# EasyEDA Pro project coildriver_new.eprj

# Schematic Schematic1
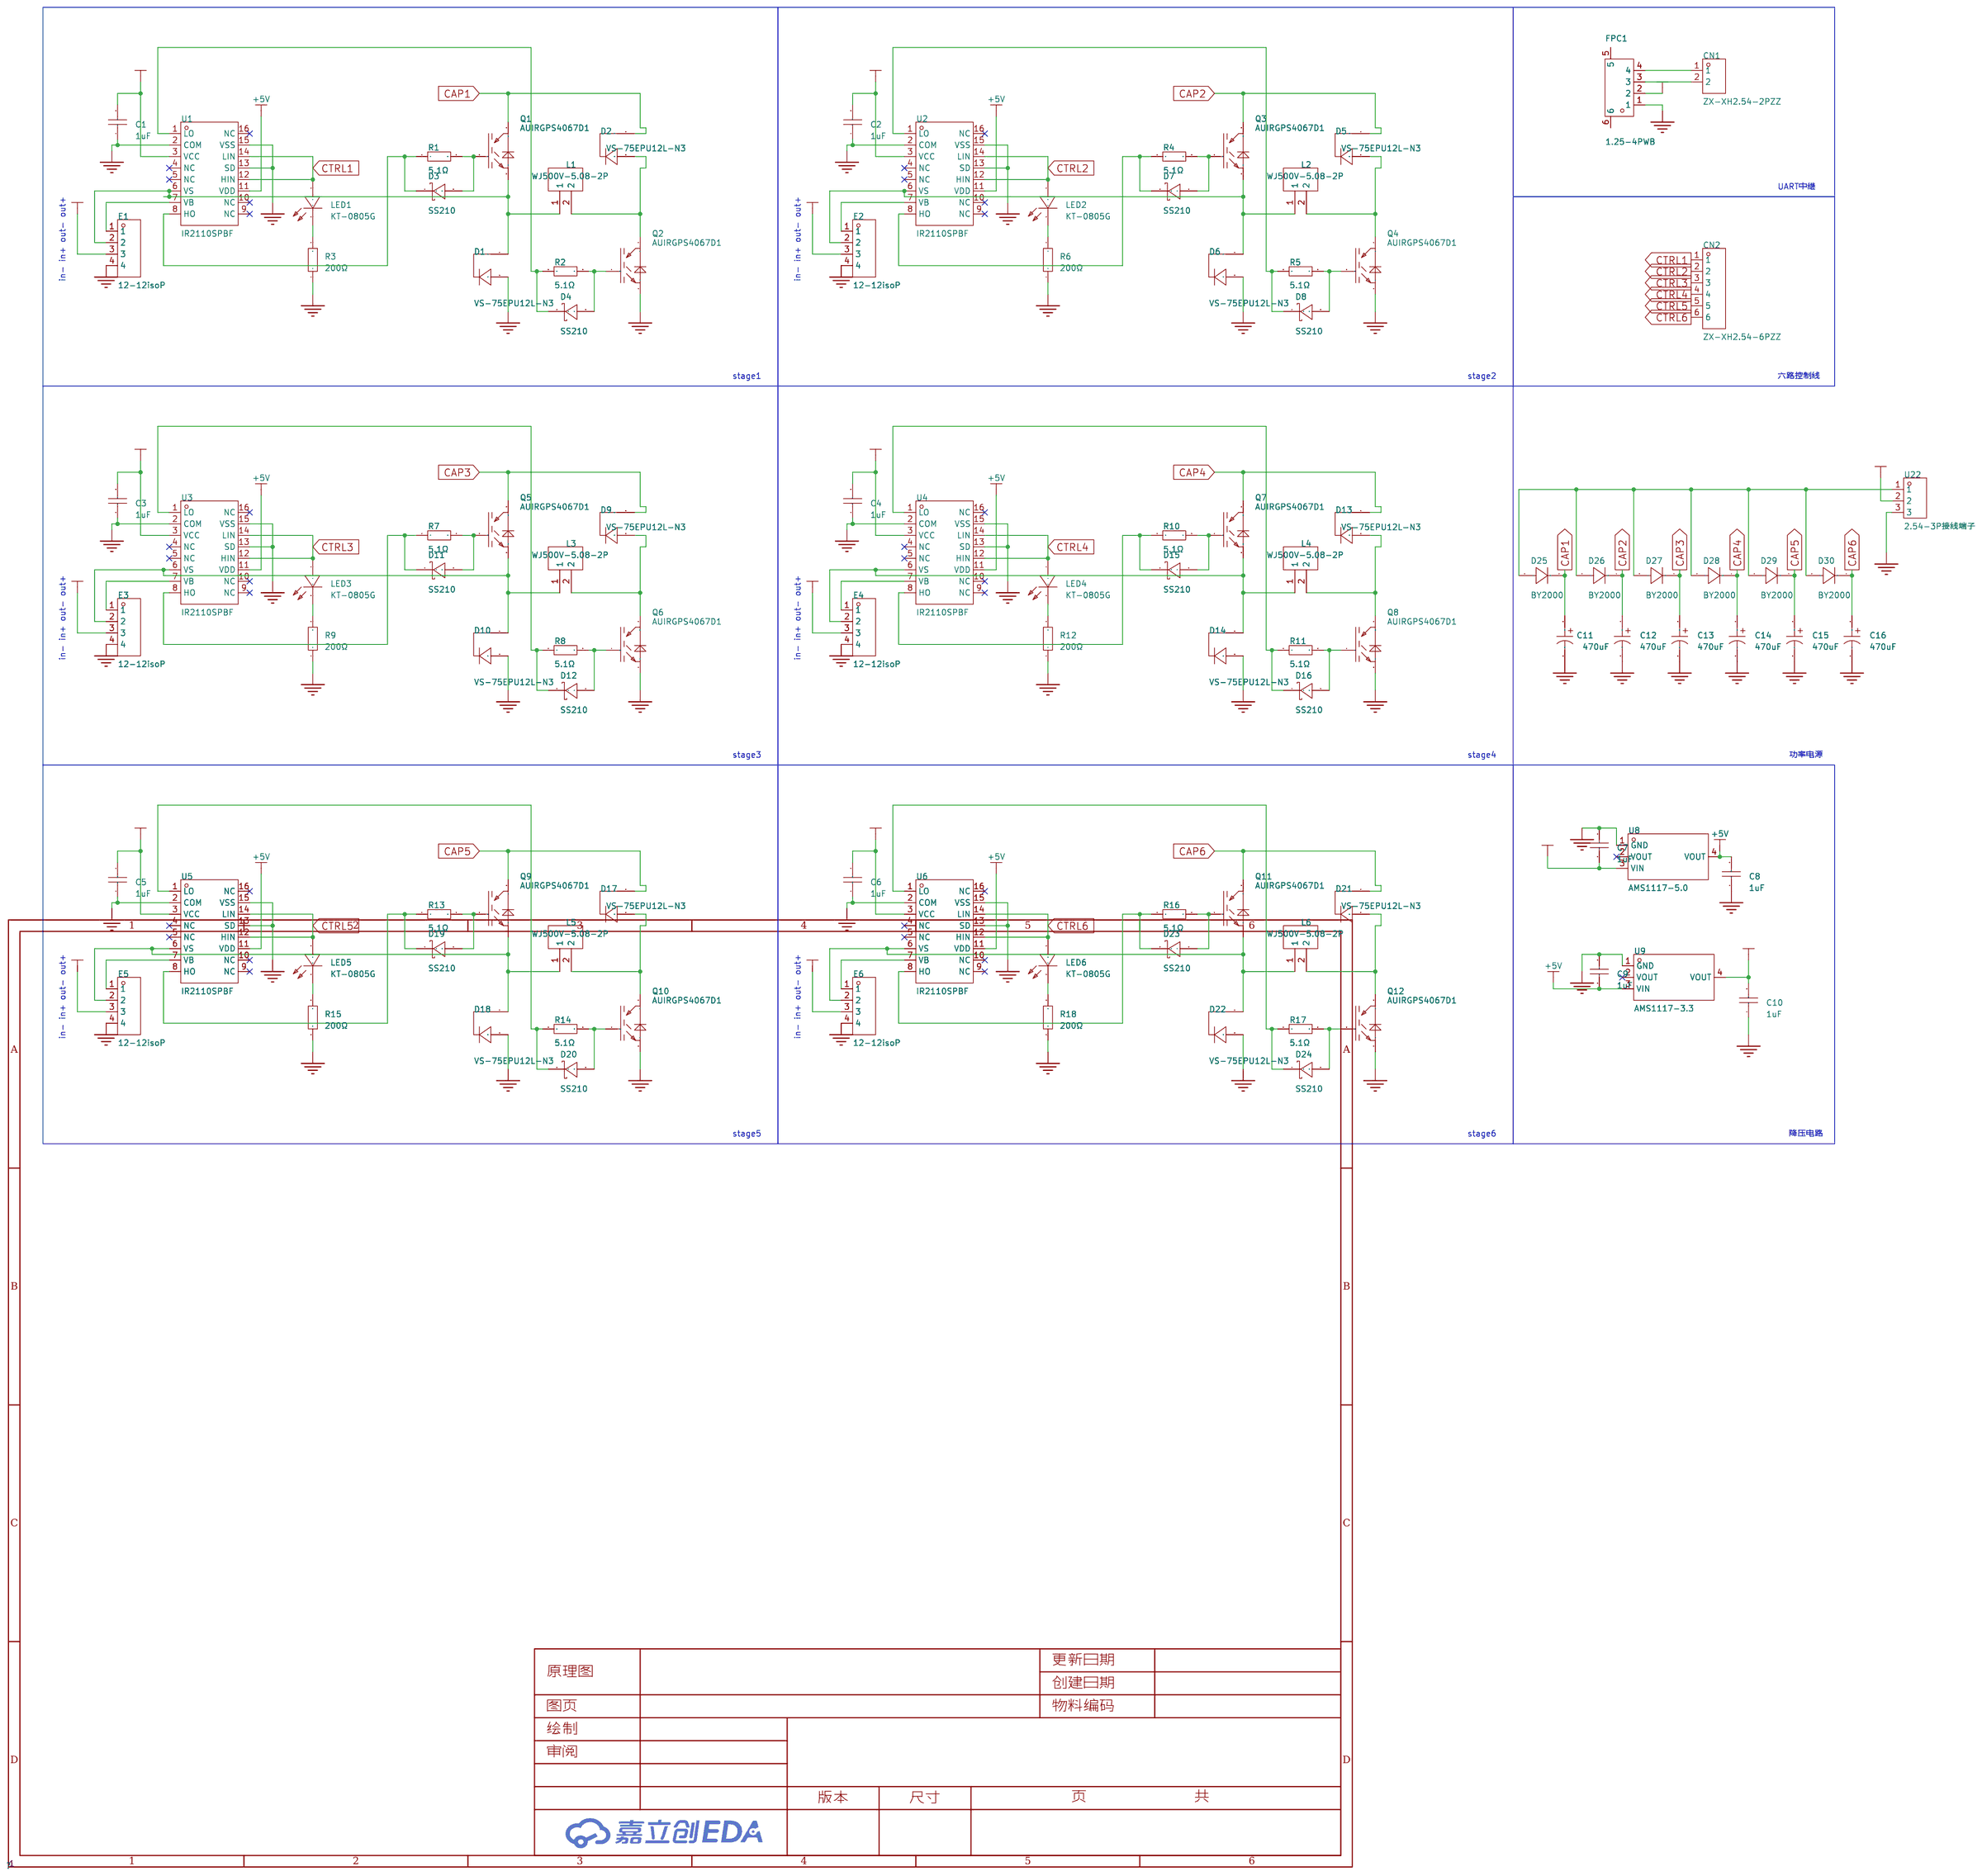
[diagram p0: schematic sheet]

## Parts
C1  1uF  [C0805]
C2  1uF  [C0805]
C3  1uF  [C0805]
C4  1uF  [C0805]
C5  1uF  [C0805]
C6  1uF  [C0805]
C7  1uF  [C0805]
C8  1uF  [C0805]
C9  1uF  [C0805]
C10  1uF  [C0805]
C11  470uF  [CAP-TH_BD35.0-P10.00-D2.3-FD]
C12  470uF  [CAP-TH_BD35.0-P10.00-D2.3-FD]
C13  470uF  [CAP-TH_BD35.0-P10.00-D2.3-FD]
C14  470uF  [CAP-TH_BD35.0-P10.00-D2.3-FD]
C15  470uF  [CAP-TH_BD35.0-P10.00-D2.3-FD]
C16  470uF  [CAP-TH_BD35.0-P10.00-D2.3-FD]
CN1  ZX-XH2.54-2PZZ  [CONN-TH_2P-P2.50_HX25003-2A]
CN2  ZX-XH2.54-6PZZ  [CONN-TH_6P-P2.50_ZX-XH2.54-6PZZ]
D1  VS-75EPU12L-N3  [TO-247-2_L15.8-W5.0-P10.92-L]
D2  VS-75EPU12L-N3  [TO-247-2_L15.8-W5.0-P10.92-L]
D3  SS210  [SMA_L4.3-W2.6-LS5.2-RD]
D4  SS210  [SMA_L4.3-W2.6-LS5.2-RD]
D5  VS-75EPU12L-N3  [TO-247-2_L15.8-W5.0-P10.92-L]
D6  VS-75EPU12L-N3  [TO-247-2_L15.8-W5.0-P10.92-L]
D7  SS210  [SMA_L4.3-W2.6-LS5.2-RD]
D8  SS210  [SMA_L4.3-W2.6-LS5.2-RD]
D9  VS-75EPU12L-N3  [TO-247-2_L15.8-W5.0-P10.92-L]
D10  VS-75EPU12L-N3  [TO-247-2_L15.8-W5.0-P10.92-L]
D11  SS210  [SMA_L4.3-W2.6-LS5.2-RD]
D12  SS210  [SMA_L4.3-W2.6-LS5.2-RD]
D13  VS-75EPU12L-N3  [TO-247-2_L15.8-W5.0-P10.92-L]
D14  VS-75EPU12L-N3  [TO-247-2_L15.8-W5.0-P10.92-L]
D15  SS210  [SMA_L4.3-W2.6-LS5.2-RD]
D16  SS210  [SMA_L4.3-W2.6-LS5.2-RD]
D17  VS-75EPU12L-N3  [TO-247-2_L15.8-W5.0-P10.92-L]
D18  VS-75EPU12L-N3  [TO-247-2_L15.8-W5.0-P10.92-L]
D19  SS210  [SMA_L4.3-W2.6-LS5.2-RD]
D20  SS210  [SMA_L4.3-W2.6-LS5.2-RD]
D21  VS-75EPU12L-N3  [TO-247-2_L15.8-W5.0-P10.92-L]
D22  VS-75EPU12L-N3  [TO-247-2_L15.8-W5.0-P10.92-L]
D23  SS210  [SMA_L4.3-W2.6-LS5.2-RD]
D24  SS210  [SMA_L4.3-W2.6-LS5.2-RD]
D25  BY2000  [DO-201_BD4.5-L7.5-P11.50-D1.2-RD]
D26  BY2000  [DO-201_BD4.5-L7.5-P11.50-D1.2-RD]
D27  BY2000  [DO-201_BD4.5-L7.5-P11.50-D1.2-RD]
D28  BY2000  [DO-201_BD4.5-L7.5-P11.50-D1.2-RD]
D29  BY2000  [DO-201_BD4.5-L7.5-P11.50-D1.2-RD]
D30  BY2000  [DO-201_BD4.5-L7.5-P11.50-D1.2-RD]
E1  12-12isoP  [HDR-TH_4P-P2.54-V-M]
E2  12-12isoP  [HDR-TH_4P-P2.54-V-M]
E3  12-12isoP  [HDR-TH_4P-P2.54-V-M]
E4  12-12isoP  [HDR-TH_4P-P2.54-V-M]
E5  12-12isoP  [HDR-TH_4P-P2.54-V-M]
E6  12-12isoP  [HDR-TH_4P-P2.54-V-M]
FPC1  1.25-4PWB  [CONN-SMD_1.25-4PWB]
L1  WJ500V-5.08-2P  [CONN-TH_2P-P5.00_WJ500V-5.08-2P]
L2  WJ500V-5.08-2P  [CONN-TH_2P-P5.00_WJ500V-5.08-2P]
L3  WJ500V-5.08-2P  [CONN-TH_2P-P5.00_WJ500V-5.08-2P]
L4  WJ500V-5.08-2P  [CONN-TH_2P-P5.00_WJ500V-5.08-2P]
L5  WJ500V-5.08-2P  [CONN-TH_2P-P5.00_WJ500V-5.08-2P]
L6  WJ500V-5.08-2P  [CONN-TH_2P-P5.00_WJ500V-5.08-2P]
LED1  KT-0805G  [LED0805-R-RD]
LED2  KT-0805G  [LED0805-R-RD]
LED3  KT-0805G  [LED0805-R-RD]
LED4  KT-0805G  [LED0805-R-RD]
LED5  KT-0805G  [LED0805-R-RD]
LED6  KT-0805G  [LED0805-R-RD]
Q1  AUIRGPS4067D1  [SUPER-247_L15.6-W5.0-P5.45-L]
Q2  AUIRGPS4067D1  [SUPER-247_L15.6-W5.0-P5.45-L]
Q3  AUIRGPS4067D1  [SUPER-247_L15.6-W5.0-P5.45-L]
Q4  AUIRGPS4067D1  [SUPER-247_L15.6-W5.0-P5.45-L]
Q5  AUIRGPS4067D1  [SUPER-247_L15.6-W5.0-P5.45-L]
Q6  AUIRGPS4067D1  [SUPER-247_L15.6-W5.0-P5.45-L]
Q7  AUIRGPS4067D1  [SUPER-247_L15.6-W5.0-P5.45-L]
Q8  AUIRGPS4067D1  [SUPER-247_L15.6-W5.0-P5.45-L]
Q9  AUIRGPS4067D1  [SUPER-247_L15.6-W5.0-P5.45-L]
Q10  AUIRGPS4067D1  [SUPER-247_L15.6-W5.0-P5.45-L]
Q11  AUIRGPS4067D1  [SUPER-247_L15.6-W5.0-P5.45-L]
Q12  AUIRGPS4067D1  [SUPER-247_L15.6-W5.0-P5.45-L]
R1  5.1Ω  [R0805]
R2  5.1Ω  [R0805]
R3  200Ω  [R0603]
R4  5.1Ω  [R0805]
R5  5.1Ω  [R0805]
R6  200Ω  [R0603]
R7  5.1Ω  [R0805]
R8  5.1Ω  [R0805]
R9  200Ω  [R0603]
R10  5.1Ω  [R0805]
R11  5.1Ω  [R0805]
R12  200Ω  [R0603]
R13  5.1Ω  [R0805]
R14  5.1Ω  [R0805]
R15  200Ω  [R0603]
R16  5.1Ω  [R0805]
R17  5.1Ω  [R0805]
R18  200Ω  [R0603]
U1  IR2110SPBF  [SOIC-16_L10.3-W7.5-P1.27-LS10.3-BL]
U2  IR2110SPBF  [SOIC-16_L10.3-W7.5-P1.27-LS10.3-BL]
U3  IR2110SPBF  [SOIC-16_L10.3-W7.5-P1.27-LS10.3-BL]
U4  IR2110SPBF  [SOIC-16_L10.3-W7.5-P1.27-LS10.3-BL]
U5  IR2110SPBF  [SOIC-16_L10.3-W7.5-P1.27-LS10.3-BL]
U6  IR2110SPBF  [SOIC-16_L10.3-W7.5-P1.27-LS10.3-BL]
U8  AMS1117-5.0  [SOT-223_L6.5-W3.5-P2.30-LS7.0-BR]
U9  AMS1117-3.3  [SOT-223-3_L6.5-W3.4-P2.30-LS7.0-BR]
U22  2.54-3P接线端子  [CONN-TH_2.54-3P]

## Library data of the parts
C1-C10 = CL21B105KBFNNNE: LCSC Part Name: 1uF ±10% 50V; Supplier Part: C28323; Manufacturer: SAMSUNG(三星); Supplier Footprint: 0805; JLCPCB Part Class: 基础库; Datasheet: https://atta.szlcsc.com/upload/public/pdf/source/20160218/1457707763339.pdf; Supplier: LCSC; Tolerance: ±10%; Voltage Rated: 50V; Temperature Coefficient: X7R
C11-C16 = 450MXG470MEFCSN35X40: LCSC Part Name: 470uF ±20% 450V; Supplier Part: C1581700; Manufacturer: rubycon(红宝石); Supplier Footprint: 插件,D35xL40mm; JLCPCB Part Class: 扩展库; Datasheet: https://atta.szlcsc.com/upload/public/pdf/source/20180704/C239328_ABA397D20D0459C98DC8752DC8B5048F.pdf; Supplier: LCSC; Tolerance: ±20%; Rated Voltage: 450V; Lead Spacing: 10mm; Ripple Current: 1.95A@120Hz; φD: 35mm; L: 40mm; Lifetime @ Temperature: 3000hrs@105℃; Operating Temperature: -25℃~+105℃
CN1 = ZX-XH2.54-2PZZ: Supplier Part: C7429632; Manufacturer: Megastar(兆星); Supplier Footprint: 插件,P=2.54mm; JLCPCB Part Class: 扩展库; Datasheet: https://atta.szlcsc.com/upload/public/pdf/source/20230619/19BA6947230AA44A04D3EDD65E618FD0.pdf; Supplier: LCSC; Pins Structure: 1x2P; Pitch: 2.54mm; Mounting Style: 直插; Reference Series: XH; Number of Pins: 2P; Number of Rows: 1; Number of PINs Per Row: 2; Current Rating (Max): 3A; Contact Material: 黄铜; Contact Plating: 锡; Operating Temperature Range: -25℃~+85℃
CN2 = ZX-XH2.54-6PZZ: Supplier Part: C7429636; Manufacturer: Megastar(兆星); Supplier Footprint: 插件,P=2.54mm; JLCPCB Part Class: 扩展库; Datasheet: https://atta.szlcsc.com/upload/public/pdf/source/20230619/1243AD0A516E39CD3D274D8985780568.pdf; Supplier: LCSC; Pins Structure: 1x6P; Pitch: 2.54mm; Mounting Style: 直插; Reference Series: XH; Number of Pins: 6P; Number of Rows: 1; Number of PINs Per Row: 6; Current Rating (Max): 3A; Contact Material: 黄铜; Contact Plating: 锡; Operating Temperature Range: -25℃~+85℃
D1 D2 D5 D6 D9 D10 D13 D14 D17 D18 D21 D22 = VS-75EPU12L-N3: LCSC Part Name: 电压:1.2kV 电流:75A; Supplier Part: C335787; Manufacturer: VISHAY(威世); Supplier Footprint: TO-247-2; JLCPCB Part Class: 扩展库; Datasheet: https://atta.szlcsc.com/upload/public/pdf/source/20181127/C335787_ECD477527F5F67B2867CBD5AAE4D0851.pdf; Supplier: LCSC; Diode Configuration: 独立式; Forward Voltage (Vf@If): 2.05V@75A; Reverse Voltage (Vr): 1.2kV; Average Rectified Current (Io): 75A; Reverse Leakage Current: 420uA@1.2kV
D3 D4 D7 D8 D11 D12 D15 D16 D19 D20 D23 D24 = SS210_C14996: LCSC Part Name: 电压:100V 电流:2A; Supplier Part: C14996; Manufacturer: MDD(辰达半导体); Supplier Footprint: SMA(DO-214AC); JLCPCB Part Class: 基础库; Datasheet: https://atta.szlcsc.com/upload/public/pdf/source/20190304/C64992_81A6AAD91A0C3D7B2CCF28903A443273.pdf; Supplier: LCSC; Forward Voltage (Vf@If): 850mV@2A; Reverse Voltage (Vr): 100V; Rectified Current: 2A; Reverse Leakage Current (Ir): 500uA@100V
D25-D30 = BY2000: LCSC Part Name: 电压:2kV 电流:3A; Supplier Part: C2974487; Manufacturer: DIOTEC(德欧泰克); Supplier Footprint: DO-201; JLCPCB Part Class: 扩展库; Datasheet: https://atta.szlcsc.com/upload/public/pdf/source/20220211/92502A012F51F25BCFF5D62494F8C595.pdf; Supplier: LCSC; Forward Voltage (Vf@If): 1.1V@3A; Reverse Voltage (Vr): 2kV; Rectified Current: 3A; Reverse Leakage Current: 5uA@2kV
E1-E6 = PZ254V-11-04P: LCSC Part Name: 间距:2.54mm 1x4P 直插 方针; Supplier Part: C2691448; Manufacturer: XFCN(兴飞); Supplier Footprint: 插件,P=2.54mm; JLCPCB Part Class: 扩展库; Datasheet: https://atta.szlcsc.com/upload/public/pdf/source/20200309/C492403_F9F19131791D08044AD4F84F8E751A34.pdf; Supplier: LCSC; Pin Structure: 1x4P; Pitch: 2.54mm; Circluar Pins/Square Pins: 方针; Mounting Type: 直插; Number of Rows: 单排; Number of Pins: 4P; Current Rating (Max): 3A; Voltage Rating (Max): 250V; Length of Mating Pin: 6mm; Insulation Height: 2.5mm; Length of End Connection Pin: 3mm; Operating Temperature Range: -40℃~+105℃; Color: 黑色
FPC1 = 1.25-4PWB: LCSC Part Name: 1x4P 间距:1.25mm 卧贴; Supplier Part: C2905011; Manufacturer: DEALON(德艺隆); Supplier Footprint: SMD,P=1.25mm,卧贴; JLCPCB Part Class: 扩展库; Datasheet: https://atta.szlcsc.com/upload/public/pdf/source/20231123/1AE0876AE9C7DCFC0D68EAC4CBA881B0.pdf; Supplier: LCSC; Pins Structure: 1x4P; Pitch: 1.25mm; Mounting Style: 卧贴; Number of Pins: 4P; Number of Rows: 1; Number of PINs Per Row: 4; Operating Temperature Range: -40℃~+85℃
L1-L6 = WJ500V-5.08-2P: LCSC Part Name: 1x2P 5.08mm 直插 排数:1 每排P数:2; Supplier Part: C8465; Manufacturer: KANGNEX(康奈克斯电气); Supplier Footprint: 插件,P=5.08mm; JLCPCB Part Class: 扩展库; Datasheet: https://atta.szlcsc.com/upload/public/pdf/source/20191225/C8465_02D34CE5B5B4A53DF5891601D97FA9F4.pdf; Supplier: LCSC; Structure: 1x2P; Pitch: 5.08mm; Color: 绿色; Mounting Style: 直插; Current Rating (Max): 18A; Voltage Rating (Max): 250V; Number of Pins: 2P; Number of Rows: 1; Wire Gauge - AWG: 14~30; Wire Gauge - mm2: 2.5; Number of PINs Per Row: 2; Operating Temperature Range: -40℃~+105℃; Screw Specification: M2.5
LED1-LED6 = KT-0805G: LCSC Part Name: 0805 翠绿 高亮; Supplier Part: C2297; Manufacturer: KENTO; Supplier Footprint: 0805; JLCPCB Part Class: 基础库; Datasheet: https://atta.szlcsc.com/upload/public/pdf/source/20170209/1486607340485.pdf; Supplier: LCSC; Emitted Color: 翠绿色
Q1-Q12 = AUIRGPS4067D1: Supplier Part: C9900044144; Supplier Footprint: Super-247; Supplier: LCSC
R1 R2 R4 R5 R7 R8 R10 R11 R13 R14 R16 R17 = 0805W8F510KT5E: LCSC Part Name: 5.1Ω ±1% 125mW 厚膜电阻; Supplier Part: C17724; Manufacturer: UNI-ROYAL(厚声); Supplier Footprint: 0805; JLCPCB Part Class: 基础库; Datasheet: https://atta.szlcsc.com/upload/public/pdf/source/20200306/C422600_1E6D84923E4A46A82E41ADD87F860B5C.pdf; Supplier: LCSC; Type: 厚膜电阻; Tolerance: ±1%; Power(Watts): 125mW; Overload Voltage (Max): 150V; Temperature Coefficient: ±400ppm/℃; Operating Temperature Range: -55℃~+155℃
R3 R6 R9 R12 R15 R18 = 0603WAF2000T5E: LCSC Part Name: 200Ω ±1% 100mW 厚膜电阻; Supplier Part: C8218; Manufacturer: UNI-ROYAL(厚声); Supplier Footprint: 0603; JLCPCB Part Class: 基础库; Datasheet: https://atta.szlcsc.com/upload/public/pdf/source/20200306/C422600_1E6D84923E4A46A82E41ADD87F860B5C.pdf; Supplier: LCSC; Type: 厚膜电阻; Tolerance: ±1%; Power(Watts): 100mW; Overload Voltage (Max): 75V; Temperature Coefficient: ±100ppm/℃; Operating Temperature Range: -55℃~+155℃
U1-U6 = IR2110SPBF: Supplier Part: C537554; Manufacturer: Infineon(英飞凌); Supplier Footprint: SOIC-16-300mil; JLCPCB Part Class: 扩展库; Datasheet: https://atta.szlcsc.com/upload/public/pdf/source/20200525/C537554_DAB217F314E1627DF0DDC7BBE3BE6BA1.pdf; Supplier: LCSC; Driven Configuration: 半桥; Load Type: MOSFET；IGBT; Number of Drivers: 2; Peak Output Current(sink): 2A; Peak Output Current(source): 2A; Supply Voltage: 3.3V~20V; Rise Time: 25ns; Fall Time: 17ns; Operating Temperature: -40℃~+150℃@(Tj)
U8 = AMS1117-5.0_C6187: LCSC Part Name: 输入12V 输出5V 1A; Supplier Part: C6187; Manufacturer: AMS; Supplier Footprint: SOT-223; JLCPCB Part Class: 基础库; Datasheet: https://atta.szlcsc.com/upload/public/pdf/source/20230918/E4B716057EE82179D88E8A0894830D59.pdf; Supplier: LCSC; Output Type: 固定; Maximum Input Voltage: 12V; Output Voltage: 5V; MAX Output Current: 1A; Power Supply Rejection Ratio (PSRR): 68dB@(120Hz); Dropout Voltage: 1.3V@(1A); Output Polarity: 正极; Number of Outputs: 1
U9 = AMS1117-3.3_C6186: LCSC Part Name: 输出3.3V 1A; Supplier Part: C6186; Manufacturer: AMS; Supplier Footprint: SOT-223; JLCPCB Part Class: 基础库; Datasheet: https://atta.szlcsc.com/upload/public/pdf/source/20180727/C6186_7A095716F0823C02F1997A905E26C086.pdf; Supplier: LCSC; Output Type: 固定; Output Voltage: 3.3V; MAX Output Current: 1A; Power Supply Rejection Ratio (PSRR): 72dB@(120Hz); Dropout Voltage: 1.3V@(800mA); Output Polarity: 正极; Number of Outputs: 1
U22 = 2.54-3P接线端子: LCSC Part Name: 接线端子 2.54mm 3P; Supplier Part: C68305; Manufacturer: BOOMELE(博穆精密); Supplier Footprint: P=2.54mm; JLCPCB Part Class: 扩展库; Datasheet: https://atta.szlcsc.com/upload/public/pdf/source/20240131/0FC6625A1FDA39D18380D30494E5C016.pdf; Supplier: LCSC

## Nets
3V3: C10.2 FPC1.2 U9.4(VOUT)
+5V: C8.2 C9.1 U1.11(VDD) U2.11(VDD) U3.11(VDD) U4.11(VDD) U5.11(VDD) U6.11(VDD) U8.4(VOUT) U9.3(VIN)
+12V: C1.2 C2.2 C3.2 C4.2 C5.2 C6.2 C7.1 E1.3 E2.3 E3.3 E4.3 E5.3 E6.3 U1.3(VCC) U2.3(VCC) U3.3(VCC) U4.3(VCC) U5.3(VCC) U6.3(VCC) U8.3(VIN) U22.2
GND: C1.1 C2.1 C3.1 C4.1 C5.1 C6.1 C7.2 C8.1 C9.2 C10.1 C11.2 C12.2 C13.2 C14.2 C15.2 C16.2 D1.3 D6.3 D10.3 D14.3 D18.3 D22.3 E1.4 E2.4 E3.4 E4.4 E5.4 E6.4 FPC1.1 Q2.3(E) Q4.3(E) Q6.3(E) Q8.3(E) Q10.3(E) Q12.3(E) R3.1 R6.1 R9.1 R12.1 R15.1 R18.1 U1.2(COM) U1.13(SD) U1.15(VSS) U2.2(COM) U2.13(SD) U2.15(VSS) U3.2(COM) U3.13(SD) U3.15(VSS) U4.2(COM) U4.13(SD) U4.15(VSS) U5.2(COM) U5.13(SD) U5.15(VSS) U6.2(COM) U6.13(SD) U6.15(VSS) U8.1(GND) U9.1(GND) U22.3
CAP1: C11.1 D2.1 D25.1(C) Q1.2(C)
CAP2: C12.1 D5.1 D26.1(C) Q3.2(C)
CAP3: C13.1 D9.1 D27.1(C) Q5.2(C)
CAP4: C14.1 D13.1 D28.1(C) Q7.2(C)
CAP5: C15.1 D17.1 D29.1(C) Q9.2(C)
CAP6: C16.1 D21.1 D30.1(C) Q11.2(C)
CTRL1: CN2.1 LED1.1(A) U1.12(HIN) U1.14(LIN)
CTRL2: CN2.2 LED2.1(A) U2.12(HIN) U2.14(LIN)
CTRL3: CN2.3 LED3.1(A) U3.12(HIN) U3.14(LIN)
CTRL4: CN2.4 LED4.1(A) U4.12(HIN) U4.14(LIN)
CTRL5: CN2.5 LED5.1(A) U5.12(HIN) U5.14(LIN)
CTRL6: CN2.6 LED6.1(A) U6.12(HIN) U6.14(LIN)
$1N409: E1.1 U1.7(VB)
$1N414: D1.1 E1.2 L1.1 Q1.3(E) U1.6(VS)
$1N1078: D3.2(A) Q1.1(G) R1.2
$1N1093: D3.1(K) R1.1 U1.8(HO)
$1N1110: D4.1(K) R2.1 U1.1(LO)
$1N1296: D2.3 L1.2 Q2.2(C)
$1N1548: D4.2(A) Q2.1(G) R2.2
$1N1761: LED1.2(K) R3.2
$1N2555: D8.1(K) R5.1 U2.1(LO)
$1N2577: E2.1 U2.7(VB)
$1N2580: D6.1 E2.2 L2.1 Q3.3(E) U2.6(VS)
$1N2587: D7.1(K) R4.1 U2.8(HO)
$1N2596: D7.2(A) Q3.1(G) R4.2
$1N2612: LED2.2(K) R6.2
$1N2625: D5.3 L2.2 Q4.2(C)
$1N2632: D8.2(A) Q4.1(G) R5.2
$1N3371: D12.1(K) R8.1 U3.1(LO)
$1N3393: E3.1 U3.7(VB)
$1N3396: D10.1 E3.2 L3.1 Q5.3(E) U3.6(VS)
$1N3403: D11.1(K) R7.1 U3.8(HO)
$1N3412: D11.2(A) Q5.1(G) R7.2
$1N3428: LED3.2(K) R9.2
$1N3441: D9.3 L3.2 Q6.2(C)
$1N3448: D12.2(A) Q6.1(G) R8.2
$1N4187: D16.1(K) R11.1 U4.1(LO)
$1N4209: E4.1 U4.7(VB)
$1N4212: D14.1 E4.2 L4.1 Q7.3(E) U4.6(VS)
$1N4219: D15.1(K) R10.1 U4.8(HO)
$1N4228: D15.2(A) Q7.1(G) R10.2
$1N4244: LED4.2(K) R12.2
$1N4257: D13.3 L4.2 Q8.2(C)
$1N4264: D16.2(A) Q8.1(G) R11.2
$1N5003: D20.1(K) R14.1 U5.1(LO)
$1N5025: E5.1 U5.7(VB)
$1N5028: D18.1 E5.2 L5.1 Q9.3(E) U5.6(VS)
$1N5035: D19.1(K) R13.1 U5.8(HO)
$1N5044: D19.2(A) Q9.1(G) R13.2
$1N5060: LED5.2(K) R15.2
$1N5073: D17.3 L5.2 Q10.2(C)
$1N5080: D20.2(A) Q10.1(G) R14.2
$1N5819: D24.1(K) R17.1 U6.1(LO)
$1N5841: E6.1 U6.7(VB)
$1N5844: D22.1 E6.2 L6.1 Q11.3(E) U6.6(VS)
$1N5851: D23.1(K) R16.1 U6.8(HO)
$1N5860: D23.2(A) Q11.1(G) R16.2
$1N5876: LED6.2(K) R18.2
$1N5889: D21.3 L6.2 Q12.2(C)
$1N5896: D24.2(A) Q12.1(G) R17.2
$1N6134: CN1.1 FPC1.4
$1N6138: CN1.2 FPC1.3
$1N11573: D25.2(A) D26.2(A) D27.2(A) D28.2(A) D29.2(A) D30.2(A) U22.1

Not connected (* = marked no-connect by the designer): FPC1 5 6; U1 4(NC)* 5(NC)* 9(NC)* 10(NC)* 16(NC)*; U2 4(NC)* 5(NC)* 9(NC)* 10(NC)* 16(NC)*; U3 4(NC)* 5(NC)* 9(NC)* 10(NC)* 16(NC)*; U4 4(NC)* 5(NC)* 9(NC)* 10(NC)* 16(NC)*; U5 4(NC)* 5(NC)* 9(NC)* 10(NC)* 16(NC)*; U6 4(NC)* 5(NC)* 9(NC)* 10(NC)* 16(NC)*; U8 2(VOUT)*; U9 2(VOUT)*

## Notes on the sheet
- UART中继
- in- in+ out- out+
- in- in+ out- out+
- stage1
- stage2
- 六路控制线
- in- in+ out- out+
- in- in+ out- out+
- stage3
- stage4
- 功率电源
- in- in+ out- out+
- in- in+ out- out+
- stage5
- stage6
- 降压电路

# Board PCB1
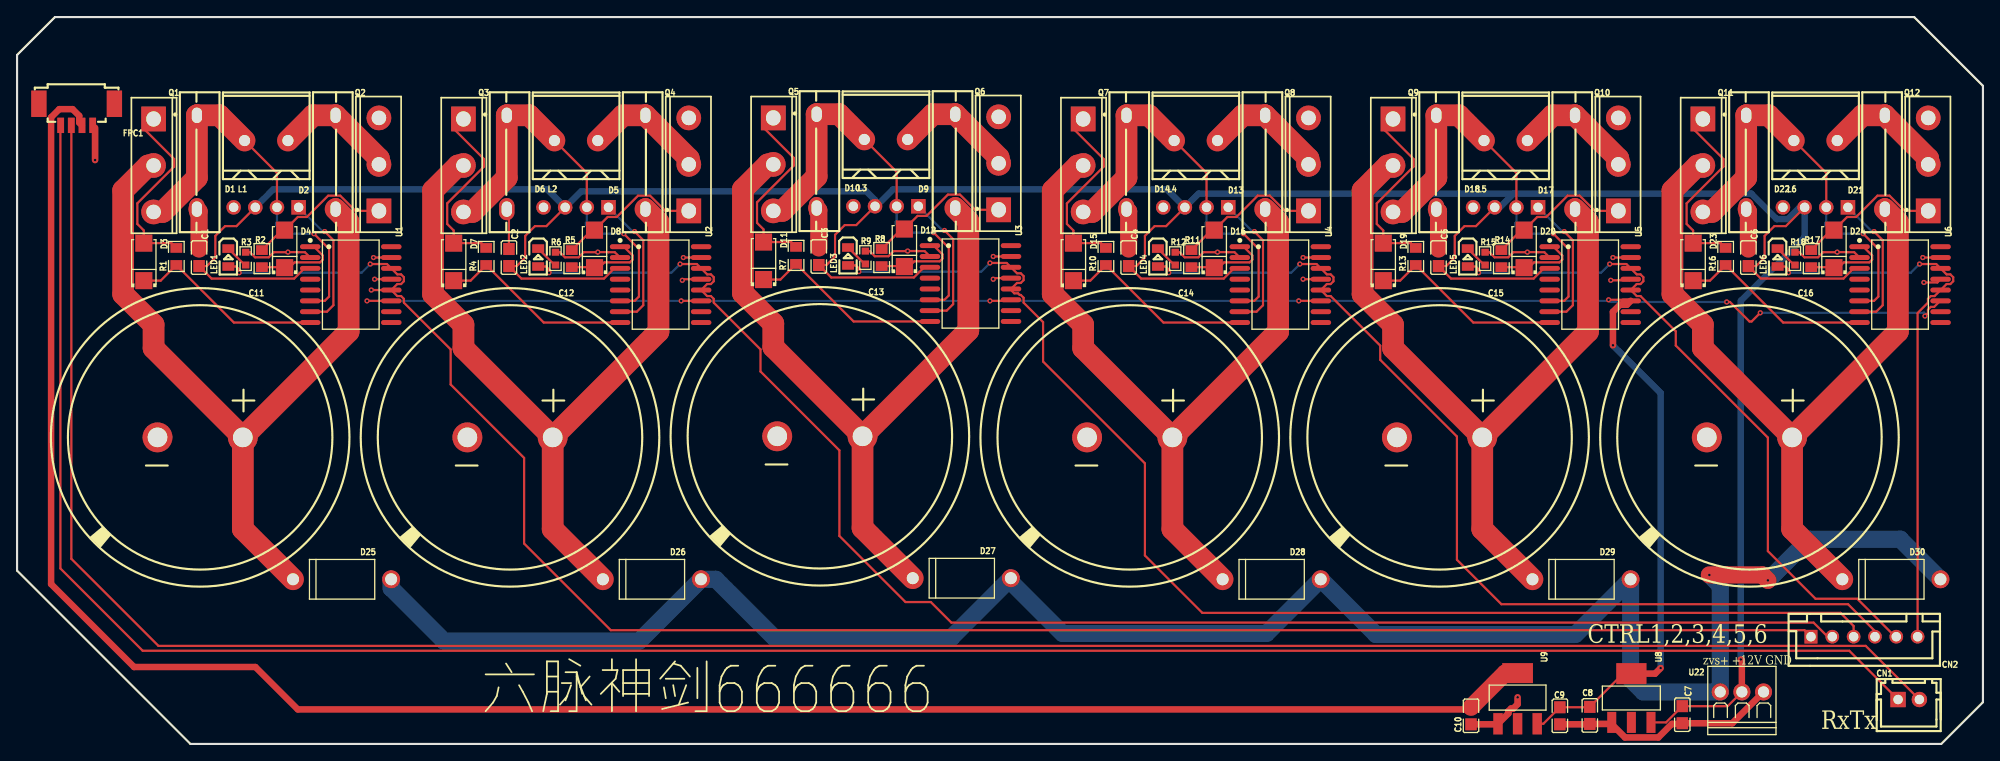
[diagram p1: board, top side]
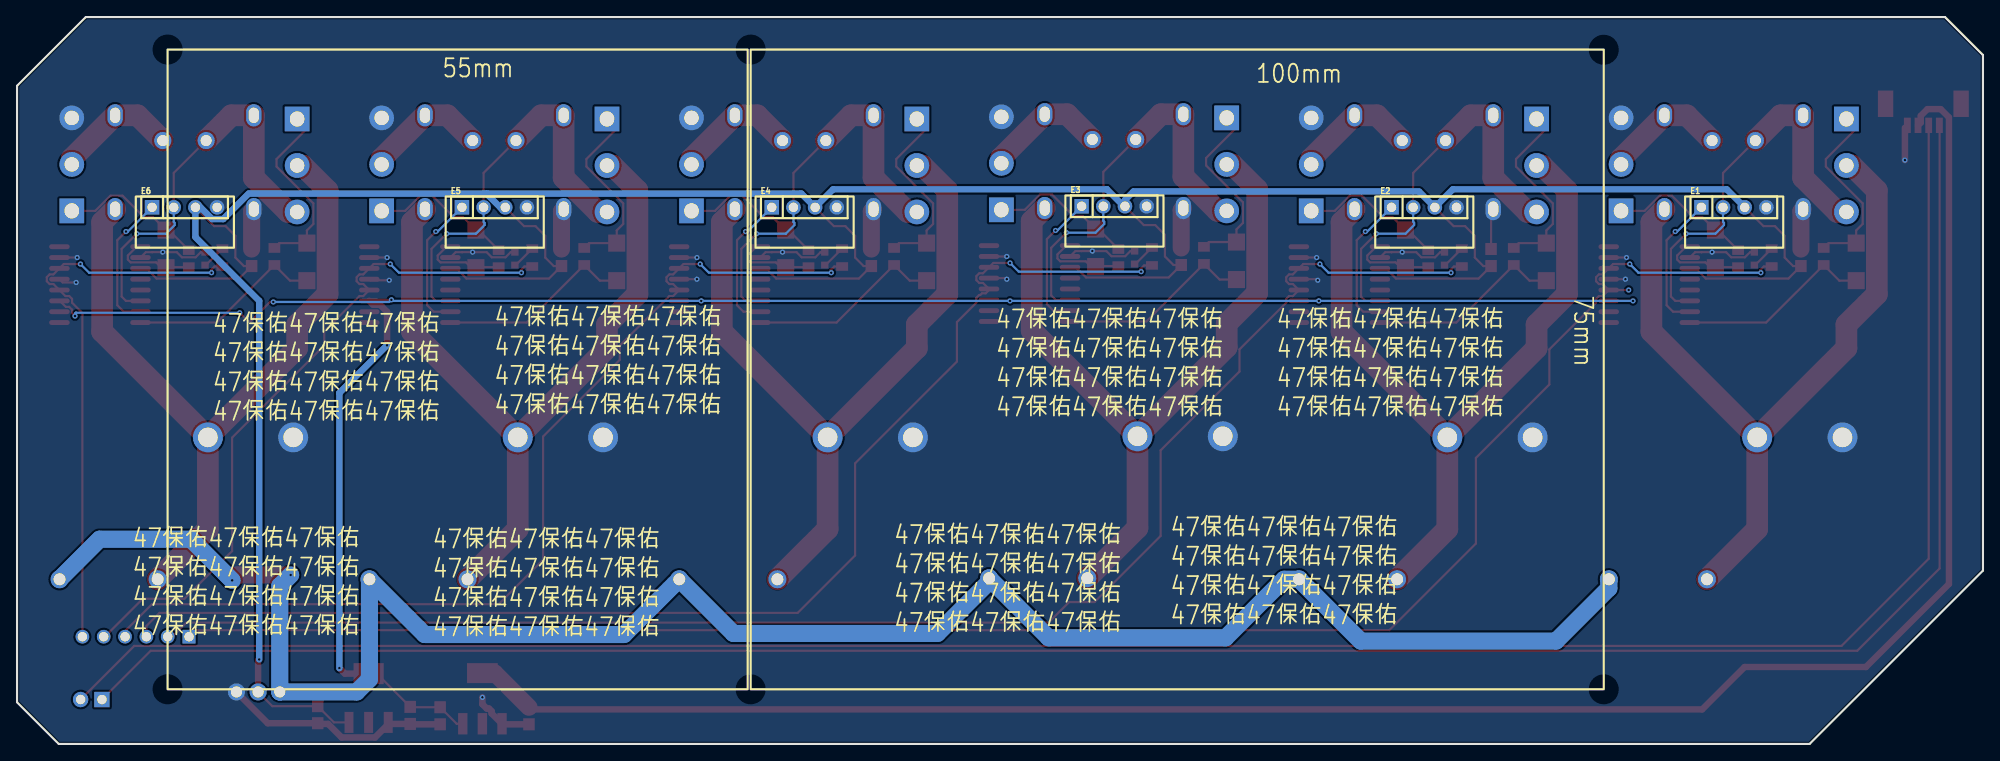
[diagram p2: board, bottom side, seen from below]

Outline 230.44 x 85.22 mm; copper layers: Top Layer, Bottom Layer. Coordinates in mm from the lower left corner of the outline.
Outline path: 0,80.77 4.45,85.22 222.38,85.22 230.44,77.15 230.44,4.89 225.55,0 20.32,0 0,20.32 0,80.77
Stack: Top Layer 0.035mm / Dielectric1 1.51mm FR4 er 4.5 / Bottom Layer 0.035mm

## Design rules (mm)
template: 自定义配置
spacing copperThickness1oz (default): track to track 0.102, other pairs 0.152 to 0.3
spacing copperThickness2oz: track to track 0.203, other pairs 0.152 to 0.3
track width copperThickness1oz (default): min 0.127, default 0.254, max 2.54
track width copperThickness2oz: min 0.203, default 0.254, max 2.54
differential pair differentialPair (default): width min 0.127, default 0.254, max 2.54; gap min 0.152, default 0.152
via viaSize (default): diameter min 0.5, default 0.61, max 10; hole min 0.3, default 0.305, max 6.3

## Placement (name value [footprint] x y rotation side)
C1  1uF  [C0805]  21.34 57.02 270 top
C2  1uF  [C0805]  57.66 57.02 270 top
C3  1uF  [C0805]  93.98 57.15 270 top
C4  1uF  [C0805]  130.3 57.02 270 top
C5  1uF  [C0805]  166.62 57.02 270 top
C6  1uF  [C0805]  202.95 57.02 270 top
C7  1uF  [C0805]  195.2 3.43 270 top
C8  1uF  [C0805]  184.36 3.34 90 top
C9  1uF  [C0805]  180.85 3.3 270 top
C10  1uF  [C0805]  170.43 3.3 90 top
C11  470uF  [CAP-TH_BD35.0-P10.00-D2.3-FD]  21.46 35.94 180 top
C12  470uF  [CAP-TH_BD35.0-P10.00-D2.3-FD]  57.78 35.94 180 top
C13  470uF  [CAP-TH_BD35.0-P10.00-D2.3-FD]  94.11 36.07 180 top
C14  470uF  [CAP-TH_BD35.0-P10.00-D2.3-FD]  130.43 35.94 180 top
C15  470uF  [CAP-TH_BD35.0-P10.00-D2.3-FD]  166.75 35.94 180 top
C16  470uF  [CAP-TH_BD35.0-P10.00-D2.3-FD]  203.07 35.94 180 top
CN1  ZX-XH2.54-2PZZ  [CONN-TH_2P-P2.50_HX25003-2A]  221.74 5.21 0 top
CN2  ZX-XH2.54-6PZZ  [CONN-TH_6P-P2.50_ZX-XH2.54-6PZZ]  216.54 12.57 180 top
D1  VS-75EPU12L-N3  [TO-247-2_L15.8-W5.0-P10.92-L]  21.08 68.2 270 top
D2  VS-75EPU12L-N3  [TO-247-2_L15.8-W5.0-P10.92-L]  37.34 68.2 90 top
D3  SS210  [SMA_L4.3-W2.6-LS5.2-RD]  14.86 56.52 90 top
D4  SS210  [SMA_L4.3-W2.6-LS5.2-RD]  31.37 58.04 90 top
D5  VS-75EPU12L-N3  [TO-247-2_L15.8-W5.0-P10.92-L]  73.66 68.2 90 top
D6  VS-75EPU12L-N3  [TO-247-2_L15.8-W5.0-P10.92-L]  57.4 68.2 270 top
D7  SS210  [SMA_L4.3-W2.6-LS5.2-RD]  51.18 56.52 90 top
D8  SS210  [SMA_L4.3-W2.6-LS5.2-RD]  67.69 58.04 90 top
D9  VS-75EPU12L-N3  [TO-247-2_L15.8-W5.0-P10.92-L]  109.98 68.33 90 top
D10  VS-75EPU12L-N3  [TO-247-2_L15.8-W5.0-P10.92-L]  93.73 68.33 270 top
D11  SS210  [SMA_L4.3-W2.6-LS5.2-RD]  87.5 56.64 90 top
D12  SS210  [SMA_L4.3-W2.6-LS5.2-RD]  104.01 58.17 90 top
D13  VS-75EPU12L-N3  [TO-247-2_L15.8-W5.0-P10.92-L]  146.3 68.2 90 top
D14  VS-75EPU12L-N3  [TO-247-2_L15.8-W5.0-P10.92-L]  130.05 68.2 270 top
D15  SS210  [SMA_L4.3-W2.6-LS5.2-RD]  123.83 56.52 90 top
D16  SS210  [SMA_L4.3-W2.6-LS5.2-RD]  140.33 58.04 90 top
D17  VS-75EPU12L-N3  [TO-247-2_L15.8-W5.0-P10.92-L]  182.63 68.2 90 top
D18  VS-75EPU12L-N3  [TO-247-2_L15.8-W5.0-P10.92-L]  166.37 68.2 270 top
D19  SS210  [SMA_L4.3-W2.6-LS5.2-RD]  160.15 56.52 90 top
D20  SS210  [SMA_L4.3-W2.6-LS5.2-RD]  176.66 58.04 90 top
D21  VS-75EPU12L-N3  [TO-247-2_L15.8-W5.0-P10.92-L]  218.95 68.2 90 top
D22  VS-75EPU12L-N3  [TO-247-2_L15.8-W5.0-P10.92-L]  202.69 68.2 270 top
D23  SS210  [SMA_L4.3-W2.6-LS5.2-RD]  196.47 56.52 90 top
D24  SS210  [SMA_L4.3-W2.6-LS5.2-RD]  212.98 58.04 90 top
D25  BY2000  [DO-201_BD4.5-L7.5-P11.50-D1.2-RD]  38.1 19.3 0 top
D26  BY2000  [DO-201_BD4.5-L7.5-P11.50-D1.2-RD]  74.42 19.3 0 top
D27  BY2000  [DO-201_BD4.5-L7.5-P11.50-D1.2-RD]  110.74 19.43 0 top
D28  BY2000  [DO-201_BD4.5-L7.5-P11.50-D1.2-RD]  147.07 19.3 0 top
D29  BY2000  [DO-201_BD4.5-L7.5-P11.50-D1.2-RD]  183.39 19.3 0 top
D30  BY2000  [DO-201_BD4.5-L7.5-P11.50-D1.2-RD]  219.71 19.3 0 top
E1  12-12isoP  [HDR-TH_4P-P2.54-V-M]  29.2 62.91 180 bottom
E2  12-12isoP  [HDR-TH_4P-P2.54-V-M]  65.52 62.91 180 bottom
E3  12-12isoP  [HDR-TH_4P-P2.54-V-M]  101.84 63.04 180 bottom
E4  12-12isoP  [HDR-TH_4P-P2.54-V-M]  138.16 62.91 180 bottom
E5  12-12isoP  [HDR-TH_4P-P2.54-V-M]  174.49 62.91 180 bottom
E6  12-12isoP  [HDR-TH_4P-P2.54-V-M]  210.81 62.91 180 bottom
FPC1  1.25-4PWB  [CONN-SMD_1.25-4PWB]  6.98 73.79 180 top
L1  WJ500V-5.08-2P  [CONN-TH_2P-P5.00_WJ500V-5.08-2P]  29.21 70.74 0 top
L2  WJ500V-5.08-2P  [CONN-TH_2P-P5.00_WJ500V-5.08-2P]  65.53 70.74 0 top
L3  WJ500V-5.08-2P  [CONN-TH_2P-P5.00_WJ500V-5.08-2P]  101.85 70.87 0 top
L4  WJ500V-5.08-2P  [CONN-TH_2P-P5.00_WJ500V-5.08-2P]  138.18 70.74 0 top
L5  WJ500V-5.08-2P  [CONN-TH_2P-P5.00_WJ500V-5.08-2P]  174.5 70.74 0 top
L6  WJ500V-5.08-2P  [CONN-TH_2P-P5.00_WJ500V-5.08-2P]  210.82 70.74 0 top
LED1  KT-0805G  [LED0805-R-RD]  24.77 57.02 270 top
LED2  KT-0805G  [LED0805-R-RD]  61.09 57.02 270 top
LED3  KT-0805G  [LED0805-R-RD]  97.41 57.15 270 top
LED4  KT-0805G  [LED0805-R-RD]  133.73 57.02 270 top
LED5  KT-0805G  [LED0805-R-RD]  170.05 57.02 270 top
LED6  KT-0805G  [LED0805-R-RD]  206.38 57.02 270 top
Q1  AUIRGPS4067D1  [SUPER-247_L15.6-W5.0-P5.45-L]  16 67.82 270 top
Q2  AUIRGPS4067D1  [SUPER-247_L15.6-W5.0-P5.45-L]  42.42 67.95 90 top
Q3  AUIRGPS4067D1  [SUPER-247_L15.6-W5.0-P5.45-L]  52.32 67.82 270 top
Q4  AUIRGPS4067D1  [SUPER-247_L15.6-W5.0-P5.45-L]  78.74 67.95 90 top
Q5  AUIRGPS4067D1  [SUPER-247_L15.6-W5.0-P5.45-L]  88.65 67.95 270 top
Q6  AUIRGPS4067D1  [SUPER-247_L15.6-W5.0-P5.45-L]  115.06 68.07 90 top
Q7  AUIRGPS4067D1  [SUPER-247_L15.6-W5.0-P5.45-L]  124.97 67.82 270 top
Q8  AUIRGPS4067D1  [SUPER-247_L15.6-W5.0-P5.45-L]  151.38 67.95 90 top
Q9  AUIRGPS4067D1  [SUPER-247_L15.6-W5.0-P5.45-L]  161.29 67.82 270 top
Q10  AUIRGPS4067D1  [SUPER-247_L15.6-W5.0-P5.45-L]  187.71 67.95 90 top
Q11  AUIRGPS4067D1  [SUPER-247_L15.6-W5.0-P5.45-L]  197.61 67.82 270 top
Q12  AUIRGPS4067D1  [SUPER-247_L15.6-W5.0-P5.45-L]  224.03 67.95 90 top
R1  5.1Ω  [R0805]  18.67 57.15 90 top
R2  5.1Ω  [R0805]  28.7 56.9 90 top
R3  200Ω  [R0603]  26.8 56.9 270 top
R4  5.1Ω  [R0805]  54.99 57.15 90 top
R5  5.1Ω  [R0805]  65.02 56.9 90 top
R6  200Ω  [R0603]  63.12 56.9 270 top
R7  5.1Ω  [R0805]  91.31 57.28 90 top
R8  5.1Ω  [R0805]  101.35 57.02 90 top
R9  200Ω  [R0603]  99.44 57.02 270 top
R10  5.1Ω  [R0805]  127.64 57.15 90 top
R11  5.1Ω  [R0805]  137.67 56.9 90 top
R12  200Ω  [R0603]  135.76 56.9 270 top
R13  5.1Ω  [R0805]  163.96 57.15 90 top
R14  5.1Ω  [R0805]  173.99 56.9 90 top
R15  200Ω  [R0603]  172.08 56.9 270 top
R16  5.1Ω  [R0805]  200.28 57.15 90 top
R17  5.1Ω  [R0805]  210.31 56.9 90 top
R18  200Ω  [R0603]  208.41 56.9 270 top
U1  IR2110SPBF  [SOIC-16_L10.3-W7.5-P1.27-LS10.3-BL]  39.12 53.85 270 top
U2  IR2110SPBF  [SOIC-16_L10.3-W7.5-P1.27-LS10.3-BL]  75.44 53.85 270 top
U3  IR2110SPBF  [SOIC-16_L10.3-W7.5-P1.27-LS10.3-BL]  111.76 53.98 270 top
U4  IR2110SPBF  [SOIC-16_L10.3-W7.5-P1.27-LS10.3-BL]  148.08 53.85 270 top
U5  IR2110SPBF  [SOIC-16_L10.3-W7.5-P1.27-LS10.3-BL]  184.4 53.85 270 top
U6  IR2110SPBF  [SOIC-16_L10.3-W7.5-P1.27-LS10.3-BL]  220.73 53.85 270 top
U8  AMS1117-5.0  [SOT-223_L6.5-W3.5-P2.30-LS7.0-BR]  189.23 5.38 270 top
U9  AMS1117-3.3  [SOT-223-3_L6.5-W3.4-P2.30-LS7.0-BR]  175.89 5.33 270 top
U22  2.54-3P接线端子  [CONN-TH_2.54-3P]  202.18 6.1 0 top

## Footprints (pads in the part's own frame, mm; a bottom-side part is the same pattern mirrored in y, then rotated)
C0805
  rect 1.41x1.35 smd: 1(-1,0) 2(1,0)
CAP-TH_BD35.0-P10.00-D2.3-FD
  round 3.5 hole 2.3: 1(-5,0) 2(5,0)
CONN-SMD_1.25-4PWB
  rect 0.8x1.8 smd: 1(-1.875,1.266) 2(-0.625,1.266) 3(0.625,1.266) 4(1.875,1.266)
  rect 1.8x3.1 smd: 5(-4.425,-1.266) 6(4.425,-1.266)
CONN-TH_2.54-3P
  round 2 hole 1.3: 1(-2.54,0) 2(0,0) 3(2.54,0)
CONN-TH_2P-P2.50_HX25003-2A
  rect 1.8x1.8 hole 1.1: 1(-1.25,0)
  round 1.8 hole 1.1: 2(1.25,0)
CONN-TH_2P-P5.00_WJ500V-5.08-2P
  round 2 hole 1.3: 1(-2.54,0) 2(2.54,0)
CONN-TH_6P-P2.50_ZX-XH2.54-6PZZ
  rect 1.524x1.6 hole 1.1: 1(6.25,0)
  round 1.6 hole 1.1: 2(3.75,0) 3(1.25,0) 4(-1.25,0) 5(-3.75,0) 6(-6.25,0)
DO-201_BD4.5-L7.5-P11.50-D1.2-RD
  round 2.1 hole 1.4: 1(-5.75,0) 2(5.75,0)
HDR-TH_4P-P2.54-V-M
  rect 1.7x1.7 hole 1.1: 1(-3.81,0)
  round 1.7 hole 1.1: 2(-1.27,0) 3(1.27,0) 4(3.81,0)
LED0805-R-RD
  rect 1x1.399 smd: 1(1.05,0) 2(-1.05,0)
R0603
  rect 0.806x0.864 smd: 1(-0.753,0) 2(0.753,0)
R0805
  rect 1.133x1.377 smd: 1(-1,0) 2(1,0)
SMA_L4.3-W2.6-LS5.2-RD
  rect 2x2 smd: 1(-2.2,0) 2(2.2,0)
SOIC-16_L10.3-W7.5-P1.27-LS10.3-BL
  oval 0.574x2.401 smd: 1(-4.445,-4.75) 2(-3.175,-4.75) 3(-1.905,-4.75) 4(-0.635,-4.75) 5(0.635,-4.75) 6(1.905,-4.75) 7(3.175,-4.75) 8(4.445,-4.75) 9(4.445,4.75) 10(3.175,4.75) 11(1.905,4.75) 12(0.635,4.75) 13(-0.635,4.75) 14(-1.905,4.75) 15(-3.175,4.75) 16(-4.445,4.75)
SOT-223-3_L6.5-W3.4-P2.30-LS7.0-BR
  rect 2.5x1.1 smd: 1(2.97,-2.3) 2(2.97,0) 3(2.97,2.3)
  rect 2.34x3.6 smd: 4(-2.97,0)
SOT-223_L6.5-W3.5-P2.30-LS7.0-BR
  rect 2.465x1.05 smd: 1(2.857,-2.3) 2(2.857,0) 3(2.857,2.3)
  rect 2.465x3.54 smd: 4(-2.857,0)
SUPER-247_L15.6-W5.0-P5.45-L
  rect 2.9x2.9 hole 1.785x1.7: 1(-5.45,0)
  round 2.9 hole 1.7: 2(0,0) 3(5.45,0)
TO-247-2_L15.8-W5.0-P10.92-L
  oval 2.6x1.8 hole 1.8x1.2: 1(-5.5,0) 3(5.5,0)

## Nets
As in the schematic.

Pads without a net: FPC1 5 6; U1 4 5 9 10 16; U2 4 5 9 10 16; U3 4 5 9 10 16; U4 4 5 9 10 16; U5 4 5 9 10 16; U6 4 5 9 10 16; U8 2; U9 2

## Via types
v1: diameter 0.61, hole 0.305, Top Layer to Bottom Layer, 58 vias

## Routing (per net, layer and track width the routed paths; a pad name or vN(x,y) marks a point on that pad's centre or on a via; arc(x,y) is an arc through that point)
3V3: length 239.6
  Top Layer w0.75: 170.43,4.05 32.91,4.05 27.94,9.02 13.72,9.02 3.99,18.75 3.99,73.46 4.95,74.42 6.5,74.42 7.29,73.64 7.29,72.84 FPC1.2
  Top Layer w1.999: C10.2 174.44,8.3 U9.4
+5V: length 264.1
  Top Layer w0.254: U9.3 178.91,2.36 C9.1 184.32,4.3 C8.2 188.26,8.24 U8.4 ; U6.11 225.43,51.94 224.72,51.24 224.33,51.24 224,50.91 224,50.52 v1(223.65,50.17) ; v1(204.34,50.55) 203.33,49.53 203.07,49.53 200.79,51.82 v1(200.41,51.82) ; v1(150.24,51.94) U4.11 ; U3.11 116.38,51.94 v1(114.05,51.94) ; v1(186.56,52.07) 189.03,52.07 U5.11 ; U1.11 v1(41.02,51.94) ; v1(77.85,51.94) U2.11
  Top Layer w0.762: v1(192.66,8.89) 192.01,8.24 U8.4 ; v1(187.07,46.74) 187.07,50.66 187.9,51.49 188.7,51.49 U5.11
  Bottom Layer w0.254: v1(204.34,50.55) 223.52,50.55 223.54,50.57 223.65,50.46 v1(223.65,50.17) ; v1(41.02,51.94) v1(77.85,51.94) v1(114.05,51.94) v1(150.24,51.94) 186.44,51.94 v1(186.56,52.07) 186.82,51.82 v1(200.41,51.82)
  Bottom Layer w0.762: v1(192.66,8.89) 192.66,41.15 v1(187.07,46.74)
+12V: length 415
  Top Layer w0.254: U8.3 193.3,2.53 C7.1 200.52,4.43 U22.2 ; U4.3 142.64,55.75 141.45,54.56 131.76,54.56 C4.2 131.21,56.02 132.21,57.02 132.21,59.56 133.35,60.71 134.69,60.71 E4.3 ; E6.3 207.33,60.71 205.99,60.71 204.85,59.56 204.85,57.02 203.85,56.02 C6.2 204.41,54.56 214.09,54.56 215.29,55.75 U6.3 ; E2.3 62.05,60.71 60.71,60.71 59.56,59.56 59.56,57.02 58.56,56.02 C2.2 59.12,54.56 68.81,54.56 70,55.75 U2.3 ; E1.3 25.72,60.71 24.38,60.71 23.24,59.56 23.24,57.02 22.24,56.02 C1.2 22.8,54.56 32.48,54.56 33.68,55.75 U1.3 ; E5.3 171.01,60.71 169.67,60.71 168.53,59.56 168.53,57.02 167.53,56.02 C5.2 168.09,54.56 177.77,54.56 178.97,55.75 U5.3 ; U3.3 106.32,55.88 105.13,54.69 95.44,54.69 C3.2 94.89,56.15 95.89,57.15 95.89,59.69 97.03,60.83 98.37,60.83 100.57,63.04
  Top Layer w0.75: U22.2 202.18,9.78 v1(202.06,9.91)
  Bottom Layer w0.75: E1.3 30.04,65.02 62.13,65.02 E2.3 66.11,64.77 99.57,64.77 100.57,63.77 100.57,62.91 102.69,65.02 134.78,65.02 E4.3 138.51,64.53 175.43,64.53 ; 175.43,64.53 173.81,62.91 E5.3 ; 175.43,64.53 203.28,64.53 206.28,61.53 207.57,61.53 208.94,62.91 E6.3 209.54,59.42 202.06,51.94 v1(202.06,9.91)
GND: length 142.5
  Top Layer w0.254: v1(223.52,54.1) 225.1,54.1 U6.13 ; U1.13 v1(41.91,54.48) ; R12.1 136.27,57.65 136.86,57.05 138.47,57.05 139.07,57.65 140.46,57.65 140.47,57.66 141.95,57.66 141.96,57.65 142.71,57.65 U4.2 ; v1(187.07,57.02) U5.15 ; C2.1 57.66,62.45 D6.3 ; R15.1 172.59,57.65 173.19,57.05 174.79,57.05 175.39,57.65 176.79,57.65 176.79,57.66 178.27,57.66 178.28,57.65 179.03,57.65 U5.2 ; U3.2 106.38,57.78 105.64,57.78 105.63,57.79 104.15,57.79 104.14,57.78 102.75,57.78 102.15,57.18 100.54,57.18 99.94,57.78 R9.1 ; v1(223.39,57.02) U6.15 ; v1(78.11,57.02) U2.15 ; v1(114.43,54.48) 114.55,54.61 U3.13 ; U2.13 78.11,54.48 v1(77.98,54.36) ; v1(150.75,57.02) U4.15 ; v1(41.78,57.02) U1.15 ; U6.2 215.35,57.65 214.6,57.65 214.59,57.66 213.12,57.66 213.11,57.65 211.71,57.65 211.12,57.05 209.51,57.05 208.91,57.65 R18.1 ; R6.1 63.62,57.65 64.22,57.05 65.83,57.05 66.43,57.65 67.82,57.65 67.83,57.66 69.31,57.66 69.31,57.65 70.06,57.65 U2.2 ; U5.13 189.03,54.36 v1(186.82,54.36) ; FPC1.1 9.14,72.24 ; R3.1 27.3,57.65 27.9,57.05 29.51,57.05 30.1,57.65 31.5,57.65 31.51,57.66 32.98,57.66 32.99,57.65 33.74,57.65 U1.2 ; v1(114.43,57.15) U3.15 ; U4.13 v1(150.75,54.48)
  Top Layer w0.762: v1(175.89,5.46) 175.89,4.66 175.38,4.15 175.12,4.15 174.81,3.84 174.81,3.58 173.53,2.3 C10.1 ; U22.3 201.06,2.43 C7.2 195.11,2.34 193.98,2.34 192.39,0.76 188.48,0.76 186.9,2.34 C8.1 184.32,2.3 C9.2 ; 9.14,72.24 v1(9.14,68.45)
  Top Layer w1.999: C6.1 202.95,62.45 D22.3 ; D1.3 21.34,62.45 C1.1 ; D14.3 130.3,62.45 C4.1 ; D18.3 166.62,62.45 C5.1 ; D10.3 93.98,62.57 C3.1
  vias: v1(31.75,57.66) v1(68.07,57.66) v1(104.4,57.79) v1(140.72,57.66) v1(177.04,57.66) v1(213.36,57.66)
CAP1: length 91.1
  Top Layer w2.54: D2.1 38.86,61.18 38.86,48.34 C11.1 ; C11.1 26.46,25.19 D25.1 ; C11.1 16,46.4 16,49.16 12.44,52.73 12.44,64.89 15.37,67.82 Q1.2
CAP2: length 91.1
  Top Layer w2.54: D26.1 62.78,25.19 C12.1 ; D5.1 75.18,61.18 75.18,48.34 C12.1 ; C12.1 52.32,46.4 52.32,49.16 48.76,52.73 48.76,64.89 51.69,67.82 Q3.2
CAP3: length 91.1
  Top Layer w2.54: Q5.2 88.01,67.95 85.08,65.02 85.08,52.85 88.65,49.29 88.65,46.53 C13.1 ; C13.1 99.11,25.32 D27.1 ; C13.1 111.51,48.47 111.51,61.3 D9.1
CAP4: length 91.1
  Top Layer w2.54: C14.1 124.97,46.4 124.97,49.16 121.4,52.73 121.4,64.89 124.33,67.82 Q7.2 ; C14.1 147.83,48.34 147.83,61.18 D13.1 ; C14.1 135.43,25.19 D28.1
CAP5: length 91.1
  Top Layer w2.54: C15.1 161.29,46.4 161.29,49.16 157.73,52.73 157.73,64.89 160.66,67.82 Q9.2 ; C15.1 171.75,25.19 D29.1 ; C15.1 184.15,48.34 184.15,61.18 D17.1
CAP6: length 91.1
  Top Layer w2.54: D21.1 220.47,61.18 220.47,48.34 C16.1 ; D30.1 208.07,25.19 C16.1 ; Q11.2 196.98,67.82 194.05,64.89 194.05,52.73 197.61,49.16 197.61,46.4 C16.1
CTRL1: length 218.7
  Top Layer w0.254: v1(41.4,56.26) 43.36,56.26 U1.14 44.57,55.05 45.01,55.05 45.35,54.72 45.35,54.25 45.01,53.92 44.57,53.92 U1.12 ; U1.12 v1(41.53,53.21) ; U1.12 44.57,52.51 45.01,52.51 45.35,52.18 45.35,51.73 50.83,46.25 50.83,42.14 59.44,33.53 59.44,23.5 69.6,13.34 209.52,13.34 CN2.1 ; LED1.1 25.69,55.97 26.1,55.56 26.1,55.31 v1(26.04,55.25)
  Bottom Layer w0.254: v1(41.4,56.26) 40.39,55.25 v1(26.04,55.25)
CTRL2: length 181.7
  Top Layer w0.254: CN2.2 212.24,12.57 210.59,14.22 109.52,14.22 107.11,16.64 104.14,16.64 96.39,24.38 96.39,34.42 87.15,43.66 87.15,46.25 81.67,51.73 81.67,52.18 81.34,52.51 80.89,52.51 U2.12 80.89,53.92 81.34,53.92 81.67,54.25 81.67,54.72 81.34,55.05 80.89,55.05 U2.14 79.68,56.26 v1(77.72,56.26) ; v1(62.36,55.25) 62.42,55.31 62.42,55.56 62.01,55.97 LED2.1
  Bottom Layer w0.254: v1(77.72,56.26) 76.71,55.25 v1(62.36,55.25)
CTRL3: length 150.4
  Top Layer w0.254: U3.12 117.21,54.04 117.66,54.04 117.99,54.38 117.99,54.84 117.66,55.18 117.21,55.18 U3.14 116,56.39 v1(114.05,56.39) ; LED3.1 98.33,56.1 98.74,55.69 98.74,55.44 v1(98.68,55.37) ; 116.51,53.21 116.89,52.83 117.33,52.83 117.53,52.64 117.66,52.64 117.99,52.3 117.99,51.73 120.27,49.45 120.27,44.83 132.21,32.89 132.21,22.1 138.94,15.37 213.74,15.37 215.28,13.82 215.28,12.45
  Bottom Layer w0.254: v1(114.05,56.39) 113.03,55.37 v1(98.68,55.37)
CTRL4: length 116.3
  Top Layer w0.254: 217.79,12.45 217.79,13.23 214.63,16.38 173.99,16.38 168.78,21.59 168.78,36.04 159.79,45.03 159.79,46.7 153.98,52.51 153.54,52.51 U4.12 153.54,53.92 153.98,53.92 154.31,54.25 154.31,54.72 153.98,55.05 153.54,55.05 U4.14 152.32,56.26 v1(150.37,56.26) ; v1(135,55.25) 135.06,55.31 135.06,55.56 134.65,55.97 LED4.1
  Bottom Layer w0.254: v1(150.37,56.26) 149.35,55.25 v1(135,55.25)
CTRL5: length 81.4
  Top Layer w0.254: LED5.1 170.98,55.97 171.39,55.56 171.39,55.31 v1(171.32,55.25) ; v1(186.69,56.26) 188.65,56.26 U5.14 189.86,55.05 190.3,55.05 190.63,54.72 190.63,54.25 190.3,53.92 189.86,53.92 U5.12 189.86,52.51 190.3,52.51 194.44,48.37 194.44,46.71 205.23,35.91 205.23,22.61 210.82,17.02 215.71,17.02 220.29,12.45
  Bottom Layer w0.254: v1(171.32,55.25) 185.67,55.25 v1(186.69,56.26)
CTRL6: length 66.7
  Top Layer w0.254: LED6.1 207.3,55.97 207.71,55.56 207.71,55.31 v1(207.64,55.25) ; v1(223.01,56.26) 224.97,56.26 U6.14 226.18,55.05 226.62,55.05 226.96,54.72 226.96,54.25 226.62,53.92 226.18,53.92 U6.12 224.77,52.51 224.33,52.51 224,52.18 224,51.73 222.79,50.52 222.79,12.45
  Bottom Layer w0.254: v1(207.64,55.25) 222,55.25 v1(223.01,56.26)
$1N409: length 16.3
  Top Layer w0.254: v1(36.07,60.07) 37.08,59.06 37.08,51.44 36.32,50.67 U1.7
  Bottom Layer w0.254: v1(36.07,60.07) 35.84,60.07 E1.1
$1N414: length 47.8
  Top Layer w0.254: v1(34.8,59.82) 36.58,58.04 36.58,52.45 36.07,51.94 U1.6 ; L1.1 30.47,66.94 E1.2
  Top Layer w2.54: Q1.3 17.07,62.37 21.08,66.38 D1.1 23.71,73.7 L1.1
  Bottom Layer w0.254: E1.2 30.47,61.2 30.35,61.09 30.35,60.83 31.37,59.82 v1(34.8,59.82)
$1N1078: length 22.5
  Top Layer w0.254: Q1.1 15.04,72.31 15.04,71.95 18.41,68.57 18.41,67.69 14.1,63.37 14.1,60.96 14.86,60.2 D3.2 18.1,58.72 R1.2
$1N1093: length 23.1
  Top Layer w0.254: U1.8 25.42,49.4 R1.1 16.83,54.32 D3.1
$1N1110: length 9.9
  Top Layer w0.254: U1.1 34.81,58.29 35.84,57.26 35.84,56.79 35.51,56.46 32.53,56.46 31.91,55.84 D4.1 31.31,55.9 R2.1
$1N1296: length 14.7
  Top Layer w2.54: Q2.2 42.42,68.62 D2.3 34.71,73.7 L1.2
$1N1548: length 17.1
  Top Layer w0.254: R2.2 31.05,60.24 D4.2 32.91,61.78 33.97,61.78 36.47,64.28 37.88,64.28 39.66,62.5 42.42,62.5
$1N1761: length 2.8
  Top Layer w0.254: R3.2 26.7,56.14 LED1.2
$1N2555: length 9.9
  Top Layer w0.254: R5.1 67.63,55.9 D8.1 68.23,55.84 68.85,56.46 71.84,56.46 72.17,56.79 72.17,57.26 71.13,58.29 U2.1
$1N2577: length 16.3
  Top Layer w0.254: U2.7 72.64,50.67 73.41,51.44 73.41,59.06 v1(72.39,60.07)
  Bottom Layer w0.254: E2.1 72.17,60.07 v1(72.39,60.07)
$1N2580: length 47.8
  Top Layer w0.254: v1(71.12,59.82) 72.9,58.04 72.9,52.45 72.39,51.94 U2.6 ; E2.2 66.79,66.94 L2.1
  Top Layer w2.54: L2.1 60.03,73.7 D6.1 57.4,66.38 53.39,62.37 Q3.3
  Bottom Layer w0.254: v1(71.12,59.82) 67.69,59.82 66.67,60.83 66.67,61.09 66.79,61.2 E2.2
$1N2587: length 23.1
  Top Layer w0.254: D7.1 53.16,54.32 R4.1 61.74,49.4 U2.8
$1N2596: length 22.5
  Top Layer w0.254: Q3.1 51.36,72.31 51.36,71.95 54.74,68.57 54.74,67.69 50.42,63.37 50.42,60.96 51.18,60.2 D7.2 54.43,58.72 R4.2
$1N2612: length 2.8
  Top Layer w0.254: R6.2 63.02,56.14 LED2.2
$1N2625: length 14.7
  Top Layer w2.54: L2.2 71.03,73.7 D5.3 78.74,68.62 Q4.2
$1N2632: length 17.1
  Top Layer w0.254: R5.2 67.37,60.24 D8.2 69.23,61.78 70.29,61.78 72.79,64.28 74.2,64.28 75.98,62.5 78.74,62.5
$1N3371: length 9.9
  Top Layer w0.254: U3.1 107.45,58.42 108.49,57.38 108.49,56.92 108.16,56.58 105.17,56.58 104.56,55.97 D12.1 103.96,56.02 R8.1
$1N3393: length 16.3
  Top Layer w0.254: U3.7 108.97,50.8 109.73,51.56 109.73,59.18 v1(108.71,60.2)
  Bottom Layer w0.254: E3.1 108.49,60.2 v1(108.71,60.2)
$1N3396: length 47.8
  Top Layer w0.254: E3.2 103.11,67.07 L3.1 ; U3.6 108.71,52.07 109.22,52.58 109.22,58.17 v1(107.44,59.94)
  Top Layer w2.54: L3.1 96.35,73.83 D10.1 93.73,66.51 89.71,62.5 88.65,62.5
  Bottom Layer w0.254: v1(107.44,59.94) 104.01,59.94 103,60.96 103,61.21 103.11,61.33 E3.2
$1N3403: length 23.1
  Top Layer w0.254: U3.8 98.06,49.53 R7.1 89.48,54.44 D11.1
$1N3412: length 22.5
  Top Layer w0.254: R7.2 90.75,58.84 D11.2 87.5,60.33 86.74,61.09 86.74,63.5 91.06,67.82 91.06,68.7 87.68,72.07 87.68,72.43 Q5.1
$1N3428: length 2.8
  Top Layer w0.254: R9.2 99.34,56.27 LED3.2
$1N3441: length 14.7
  Top Layer w2.54: L3.2 107.35,73.83 D9.3 115.06,68.75 Q6.2
$1N3448: length 17.1
  Top Layer w0.254: Q6.1 112.31,62.62 110.52,64.41 109.11,64.41 106.62,61.91 105.55,61.91 D12.2 103.69,60.37 R8.2
$1N4187: length 9.9
  Top Layer w0.254: R11.1 140.28,55.9 D16.1 140.88,55.84 141.5,56.46 144.48,56.46 144.81,56.79 144.81,57.26 143.78,58.29 U4.1
$1N4209: length 16.3
  Top Layer w0.254: U4.7 145.29,50.67 146.05,51.44 146.05,59.06 v1(145.03,60.07)
  Bottom Layer w0.254: v1(145.03,60.07) 144.81,60.07 E4.1
$1N4212: length 47.8
  Top Layer w0.254: v1(143.76,59.82) 145.54,58.04 145.54,52.45 145.03,51.94 U4.6 ; E4.2 139.43,66.94 L4.1
  Top Layer w2.54: L4.1 132.68,73.7 D14.1 130.05,66.38 126.03,62.37 Q7.3
  Bottom Layer w0.254: E4.2 139.43,61.2 139.32,61.09 139.32,60.83 140.33,59.82 v1(143.76,59.82)
$1N4219: length 23.1
  Top Layer w0.254: U4.8 134.38,49.4 R10.1 125.8,54.32 D15.1
$1N4228: length 22.5
  Top Layer w0.254: Q7.1 124,72.31 124,71.95 127.38,68.57 127.38,67.69 123.06,63.37 123.06,60.96 123.83,60.2 D15.2 127.07,58.72 R10.2
$1N4244: length 2.8
  Top Layer w0.254: R12.2 135.66,56.14 LED4.2
$1N4257: length 14.7
  Top Layer w2.54: Q8.2 151.38,68.62 D13.3 143.68,73.7 L4.2
$1N4264: length 17.1
  Top Layer w0.254: 151.38,62.5 148.63,62.5 146.85,64.28 145.44,64.28 142.94,61.78 141.88,61.78 D16.2 140.01,60.24 R11.2
$1N5003: length 9.9
  Top Layer w0.254: R14.1 176.6,55.9 D20.1 177.2,55.84 177.82,56.46 180.8,56.46 181.13,56.79 181.13,57.26 180.1,58.29 U5.1
$1N5025: length 16.3
  Top Layer w0.254: U5.7 181.61,50.67 182.37,51.44 182.37,59.06 v1(181.36,60.07)
  Bottom Layer w0.254: v1(181.36,60.07) 181.13,60.07 E5.1
$1N5028: length 47.8
  Top Layer w0.254: E5.2 175.75,66.94 L5.1 ; v1(180.09,59.82) 181.86,58.04 181.86,52.45 181.36,51.94 U5.6
  Top Layer w2.54: Q9.3 162.36,62.37 166.37,66.38 D18.1 169,73.7 L5.1
  Bottom Layer w0.254: v1(180.09,59.82) 176.66,59.82 175.64,60.83 175.64,61.09 175.75,61.2 E5.2
$1N5035: length 23.1
  Top Layer w0.254: U5.8 170.7,49.4 R13.1 162.12,54.32 D19.1
$1N5044: length 22.5
  Top Layer w0.254: Q9.1 160.33,72.31 160.33,71.95 163.7,68.57 163.7,67.69 159.38,63.37 159.38,60.96 160.15,60.2 D19.2 163.39,58.72 R13.2
$1N5060: length 2.8
  Top Layer w0.254: LED5.2 171.98,56.14 R15.2
$1N5073: length 14.7
  Top Layer w2.54: L5.2 180,73.7 D17.3 187.71,68.62 Q10.2
$1N5080: length 17.1
  Top Layer w0.254: R14.2 176.33,60.24 D20.2 178.2,61.78 179.26,61.78 181.76,64.28 183.17,64.28 184.95,62.5 187.71,62.5
$1N5819: length 9.9
  Top Layer w0.254: U6.1 216.42,58.29 217.45,57.26 217.45,56.79 217.12,56.46 214.14,56.46 213.52,55.84 D24.1 212.92,55.9 R17.1
$1N5841: length 16.3
  Top Layer w0.254: v1(217.68,60.07) 218.69,59.06 218.69,51.44 217.93,50.67 U6.7
  Bottom Layer w0.254: E6.1 217.45,60.07 v1(217.68,60.07)
$1N5844: length 47.8
  Top Layer w0.254: L6.1 212.08,66.94 E6.2 ; U6.6 217.68,51.94 218.19,52.45 218.19,58.04 v1(216.41,59.82)
  Top Layer w2.54: Q11.3 198.68,62.37 202.69,66.38 D22.1 205.32,73.7 L6.1
  Bottom Layer w0.254: E6.2 212.08,61.2 211.96,61.09 211.96,60.83 212.98,59.82 v1(216.41,59.82)
$1N5851: length 23.1
  Top Layer w0.254: D23.1 198.44,54.32 R16.1 207.03,49.4 U6.8
$1N5860: length 22.5
  Top Layer w0.254: Q11.1 196.65,72.31 196.65,71.95 200.02,68.57 200.02,67.69 195.71,63.37 195.71,60.96 196.47,60.2 D23.2 199.71,58.72 R16.2
$1N5876: length 2.8
  Top Layer w0.254: LED6.2 208.31,56.14 R18.2
$1N5889: length 14.7
  Top Layer w2.54: L6.2 216.32,73.7 D21.3 224.03,68.62 Q12.2
$1N5896: length 17.1
  Top Layer w0.254: R17.2 212.66,60.24 D24.2 214.52,61.78 215.58,61.78 218.08,64.28 219.49,64.28 221.27,62.5 224.03,62.5
$1N6134: length 273.7
  Top Layer w0.254: FPC1.4 5.08,72.49 5.08,20.57 14.73,10.92 214.78,10.92 CN1.1
$1N6138: length 274.3
  Top Layer w0.254: CN1.2 216.7,11.49 16.57,11.49 6.36,21.71 FPC1.3
$1N11573: length 236.9
  Top Layer w1.999: v1(205.23,19.18) 204.6,19.81 v1(198.37,19.81)
  Bottom Layer w1.999: D25.2 43.85,18.25 50.04,12.07 72.93,12.07 D26.2 81.92,19.3 88.77,12.45 109.51,12.45 D27.2 116.49,19.02 122.55,12.95 146.47,12.95 D28.2 159.29,12.83 182.66,12.83 D29.2 189.14,7.59 190.63,6.1 U22.1 199.64,18.54 v1(198.37,19.81) ; v1(205.23,19.18) 210.06,24 220.76,24 D30.2

## Copper pours and planes (outline as drawn; the poured copper is in the pictures)
GND on Bottom Layer: -25.4,113.28 302.51,113.28 302.51,-55.75 -25.4,-55.75

## Text on the board
Bottom Silkscreen Layer: 100mm | 75mm | 55mm | 47保佑47保佑47保佑 / 47保佑47保佑47保佑 / 47保佑47保佑47保佑 / 47保佑47保佑47保佑
Top Silkscreen Layer: zvs+ +12V GND | CTRL1,2,3,4,5,6 | RxTx | 六脉神剑666666
